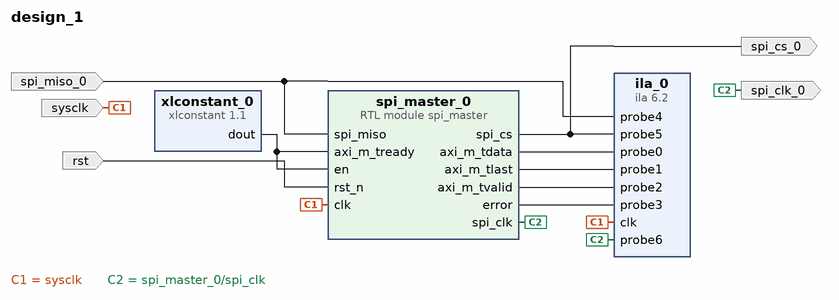
[diagram p0: block diagram of the top level]
# Vivado block design design_1, xc7z020clg400-1, Vivado 2018.3
create_bd_design design_1

create_bd_port -dir I spi_miso_0
create_bd_port -dir O -type clk spi_clk_0
create_bd_port -dir O spi_cs_0
create_bd_port -dir I -type clk sysclk
set_property -dict {CONFIG.FREQ_HZ 100000000} [get_bd_ports sysclk]
create_bd_port -dir I -type rst rst

create_bd_cell -type ip -vlnv xilinx.com:ip:ila:6.2 ila_0
set_property -dict [list \
  CONFIG.ALL_PROBE_SAME_MU_CNT 2 \
  CONFIG.C_ADV_TRIGGER true \
  CONFIG.C_DATA_DEPTH 8192 \
  CONFIG.C_ENABLE_ILA_AXI_MON false \
  CONFIG.C_EN_STRG_QUAL 0 \
  CONFIG.C_MONITOR_TYPE Native \
  CONFIG.C_NUM_OF_PROBES 7 \
  CONFIG.C_PROBE0_MU_CNT 2 \
  CONFIG.C_PROBE0_WIDTH 32 \
  CONFIG.C_PROBE1_MU_CNT 2 \
  CONFIG.C_PROBE2_MU_CNT 2 \
  CONFIG.C_PROBE3_MU_CNT 2 \
  CONFIG.C_PROBE4_MU_CNT 2 \
  CONFIG.C_PROBE5_MU_CNT 2 \
  CONFIG.C_PROBE6_MU_CNT 2 \
] [get_bd_cells ila_0]
create_bd_cell -type ip -vlnv xilinx.com:ip:xlconstant:1.1 xlconstant_0
create_bd_cell -type module -reference spi_master spi_master_0

# ---- connections ----

connect_bd_net -net spi_miso_0_1 [get_bd_ports spi_miso_0] [get_bd_pins spi_master_0/spi_miso] [get_bd_pins ila_0/probe4]
connect_bd_net [get_bd_pins spi_master_0/spi_cs] [get_bd_ports spi_cs_0] [get_bd_pins ila_0/probe5]
connect_bd_net [get_bd_pins spi_master_0/axi_m_tdata] [get_bd_pins ila_0/probe0]
connect_bd_net [get_bd_pins spi_master_0/axi_m_tlast] [get_bd_pins ila_0/probe1]
connect_bd_net [get_bd_pins spi_master_0/axi_m_tvalid] [get_bd_pins ila_0/probe2]
connect_bd_net [get_bd_pins spi_master_0/error] [get_bd_pins ila_0/probe3]
connect_bd_net [get_bd_pins xlconstant_0/dout] [get_bd_pins spi_master_0/en] [get_bd_pins spi_master_0/axi_m_tready]
connect_bd_net [get_bd_ports sysclk] [get_bd_pins spi_master_0/clk] [get_bd_pins ila_0/clk]
connect_bd_net [get_bd_pins spi_master_0/spi_clk] [get_bd_ports spi_clk_0] [get_bd_pins ila_0/probe6]
connect_bd_net [get_bd_ports rst] [get_bd_pins spi_master_0/rst_n]

validate_bd_design
save_bd_design
